# EAGLE schematic power (EAGLE 9.6.2)
Assembly variants: basic
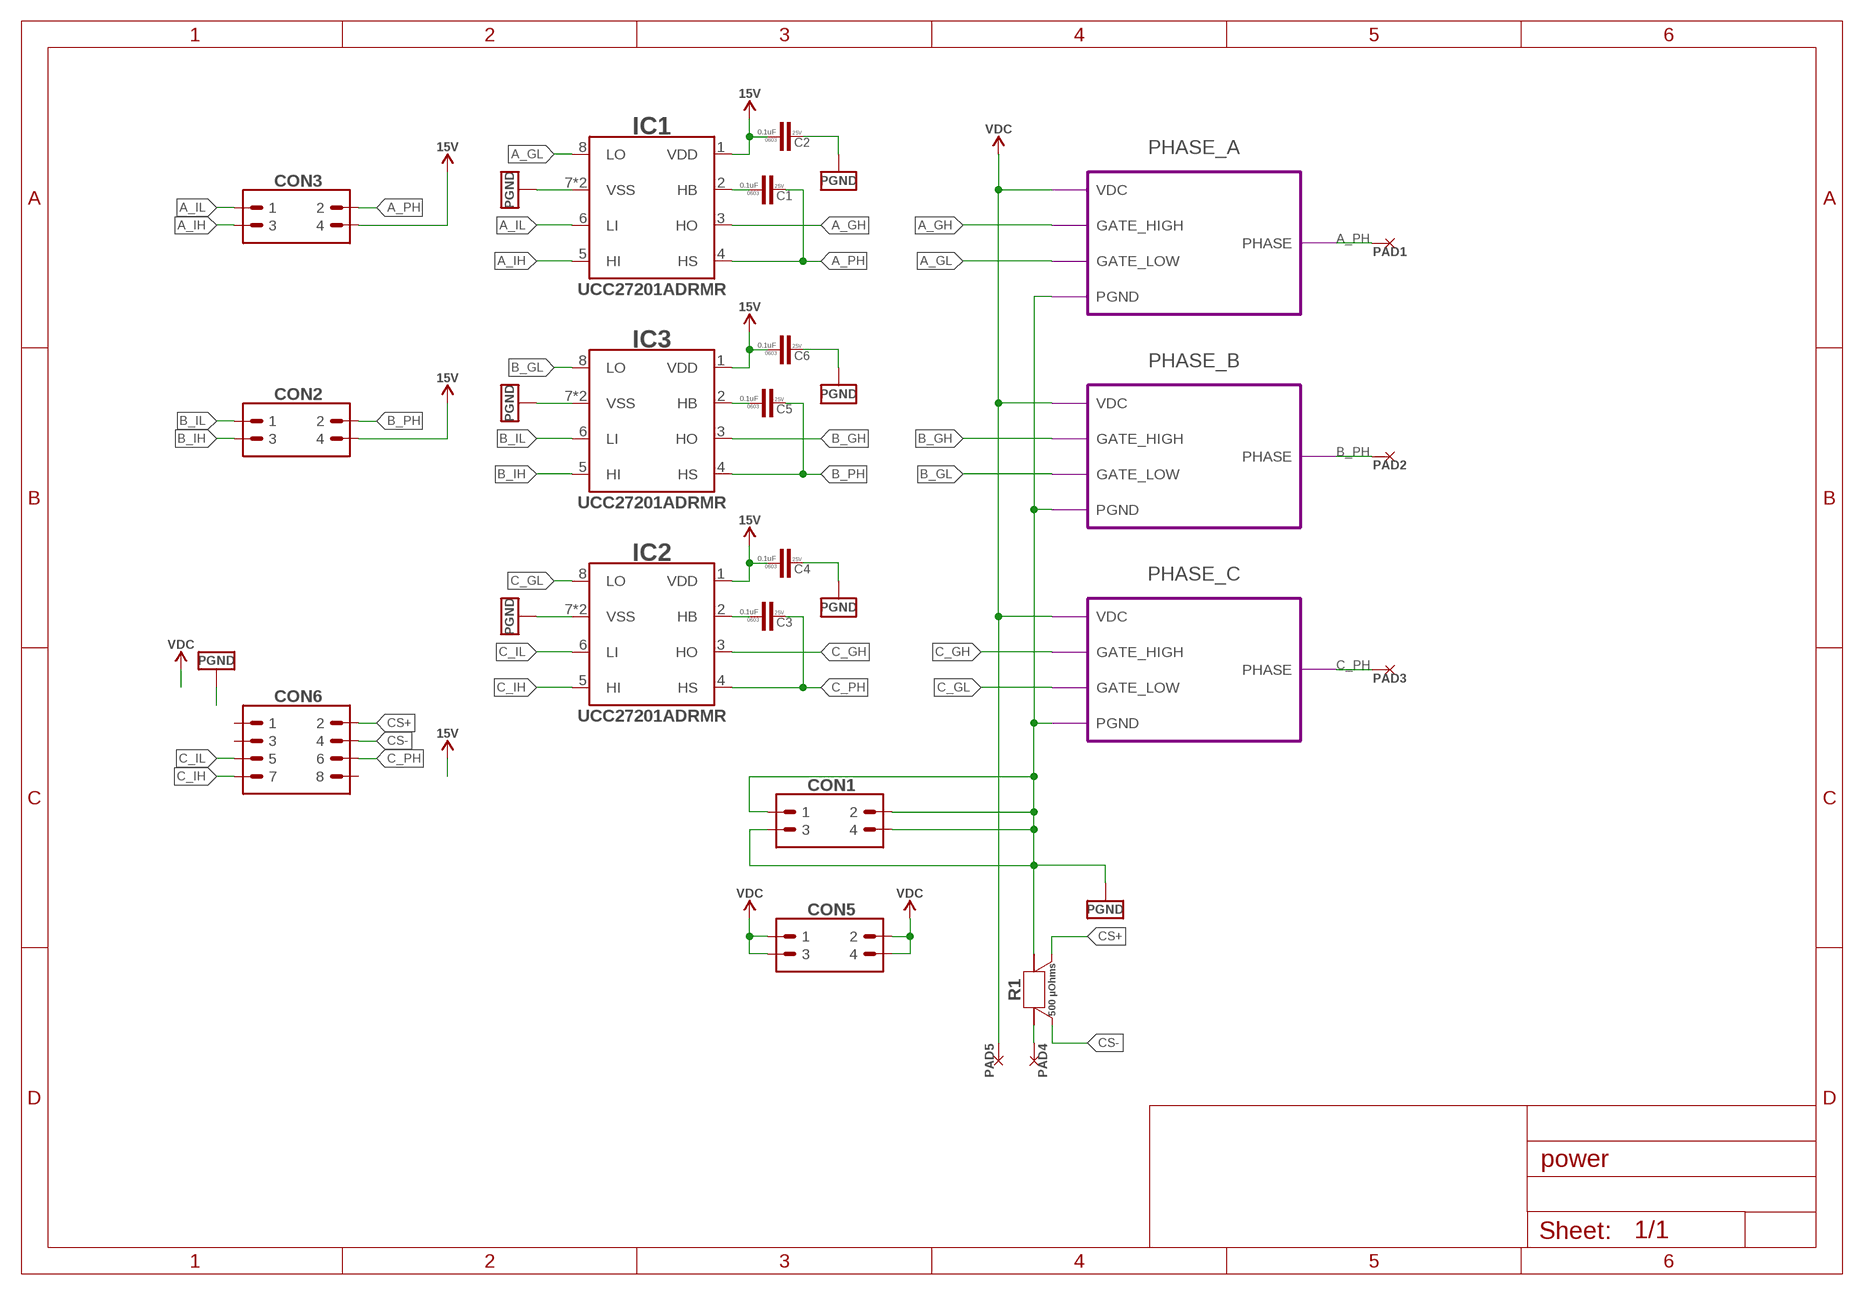
[diagram p0: schematic, sheet 1]

## Parts
C1  0.1uF  C-0603  [C0603]
C2  0.1uF  C-0603  [C0603]
C3  0.1uF  C-0603  [C0603]
C4  0.1uF  C-0603  [C0603]
C5  0.1uF  C-0603  [C0603]
C6  0.1uF  C-0603  [C0603]
CON1  PINHEAD_2X02-0877590414  [2X02-SMD-2-MALE]
CON2  PINHEAD_2X02-0877590414  [2X02-SMD-2-MALE]
CON3  PINHEAD_2X02-0877590414  [2X02-SMD-2-MALE]
CON5  PINHEAD_2X02-0877590414  [2X02-SMD-2-MALE]
CON6  PINHEAD_2X04-SMD-2-MALE  [2X04-SMD-2-MALE]
IC1  UCC272-VDFN-HEAVY_PCB  [VDFN-8-HEAVY-PCB]
IC2  UCC272-VDFN-HEAVY_PCB  [VDFN-8-HEAVY-PCB]
IC3  UCC272-VDFN-HEAVY_PCB  [VDFN-8-HEAVY-PCB]
PAD1  PAD-5X8  [5X8]  (not fitted in variant basic)
PAD2  PAD-5X8  [5X8]  (not fitted in variant basic)
PAD3  PAD-5X8  [5X8]  (not fitted in variant basic)
PAD4  PAD-5X4  [5X4]  (not fitted in variant basic)
PAD5  PAD-5X4  [5X4]  (not fitted in variant basic)
R1  500 µOhms  CURRENT_SHUNT_KELVIN-0.0005R-3920-KELVIN  [R3920-KELVIN]

## Module instances
PHASE_A = PHASE (part numbers offset by 100)
PHASE_B = PHASE (part numbers offset by 200)
PHASE_C = PHASE (part numbers offset by 300)

## Nets
A_GH: IC1.3(HO) ; port PHASE_A.GATE_HIGH
A_GL: IC1.8(LO) ; port PHASE_A.GATE_LOW
A_IH: CON3.3 IC1.5(HI)
A_IL: CON3.1 IC1.6(LI)
A_PH: C1.2 CON3.2 IC1.4(HS) PAD1.P$1 ; port PHASE_A.PHASE
B_GH: IC3.3(HO) ; port PHASE_B.GATE_HIGH
B_GL: IC3.8(LO) ; port PHASE_B.GATE_LOW
B_IH: CON2.3 IC3.5(HI)
B_IL: CON2.1 IC3.6(LI)
B_PH: C5.2 CON2.2 IC3.4(HS) PAD2.P$1 ; port PHASE_B.PHASE
C_GH: IC2.3(HO) ; port PHASE_C.GATE_HIGH
C_GL: IC2.8(LO) ; port PHASE_C.GATE_LOW
C_IH: CON6.7 IC2.5(HI)
C_IL: CON6.5 IC2.6(LI)
C_PH: C3.2 CON6.6 IC2.4(HS) PAD3.P$1 ; port PHASE_C.PHASE
CS+: CON6.2 R1.S2
CS-: CON6.4 R1.S1
N$1: C3.1 IC2.2(HB)
N$2: C5.1 IC3.2(HB)
N$7: PAD4.P$1 R1.1 R1.11
N$13: C1.1 IC1.2(HB)
PGND: C2.2 C4.2 C6.2 CON1.1 CON1.2 CON1.3 CON1.4 IC1.7(VSS) IC1.P$1(VSS) IC2.7(VSS) IC2.P$1(VSS) IC3.7(VSS) IC3.P$1(VSS) R1.2 R1.22 ; port PHASE_A.PGND PHASE_C.PGND PHASE_B.PGND
VDC [HV]: CON5.1 CON5.2 CON5.3 CON5.4 PAD5.P$1 ; port PHASE_B.VDC PHASE_A.VDC PHASE_C.VDC
VDD_15V: C2.1 C4.1 C6.1 CON2.4 CON3.4 IC1.1(VDD) IC2.1(VDD) IC3.1(VDD) ; supply symbol labelled 15V
Unconnected: CON6.1 CON6.3 CON6.8

## Library data of the parts
C1-C6 = rc:C; AEC-Q: ---; DIGIKEY#: 1276-1006-1-ND; MANF: Samsung Electro-Mechanics; MANF#: CL10B104KA8NNNC; OPERATING_TEMP: -55°C ~ 125°C; PACKAGE: 0603; VOLTAGE: 25V
CON1-CON3 CON5 = pinhead:PINHEAD_2X02; DIGIKEY#: WM18712-ND; MANF: Molex; MANF#: 0877590414
CON6 = pinhead:PINHEAD_2X04; DIGIKEY#: WM14802-ND; MANF: Molex; MANF#: 0877590814
IC1-IC3 = mosfet_drivers:UCC272: Half-Bridge Gate Driver IC Non-Inverting 8-SO PowerPad; DIGIKEY#: 296-UCC27201ADRMRTR-ND; LCSC#: C47661; MANF: Texas Instruments; MANF#: UCC27201ADRMR
PAD1-PAD3 = PADS:PAD
PAD4 PAD5 = PADS:PAD; BOM: EXCLUDE
R1 = SHUNT_RESISTORS:CURRENT_SHUNT_KELVIN; DIGIKEY#: CSS2H-3920R-L500FCT-ND; MANF: Bourns Inc; MANF#: CSS2H-3920R-L500F; OPERATING_TEMP: -55°C ~ 170°C; PACKAGE: 3920; POWER: 9W; TC: ±50ppm/°C; TOLERANCE: ±1%

## Module PHASE
Ports: GATE_HIGH(in) GATE_LOW(in) PHASE(io) PGND(pwr) VDC(pwr)
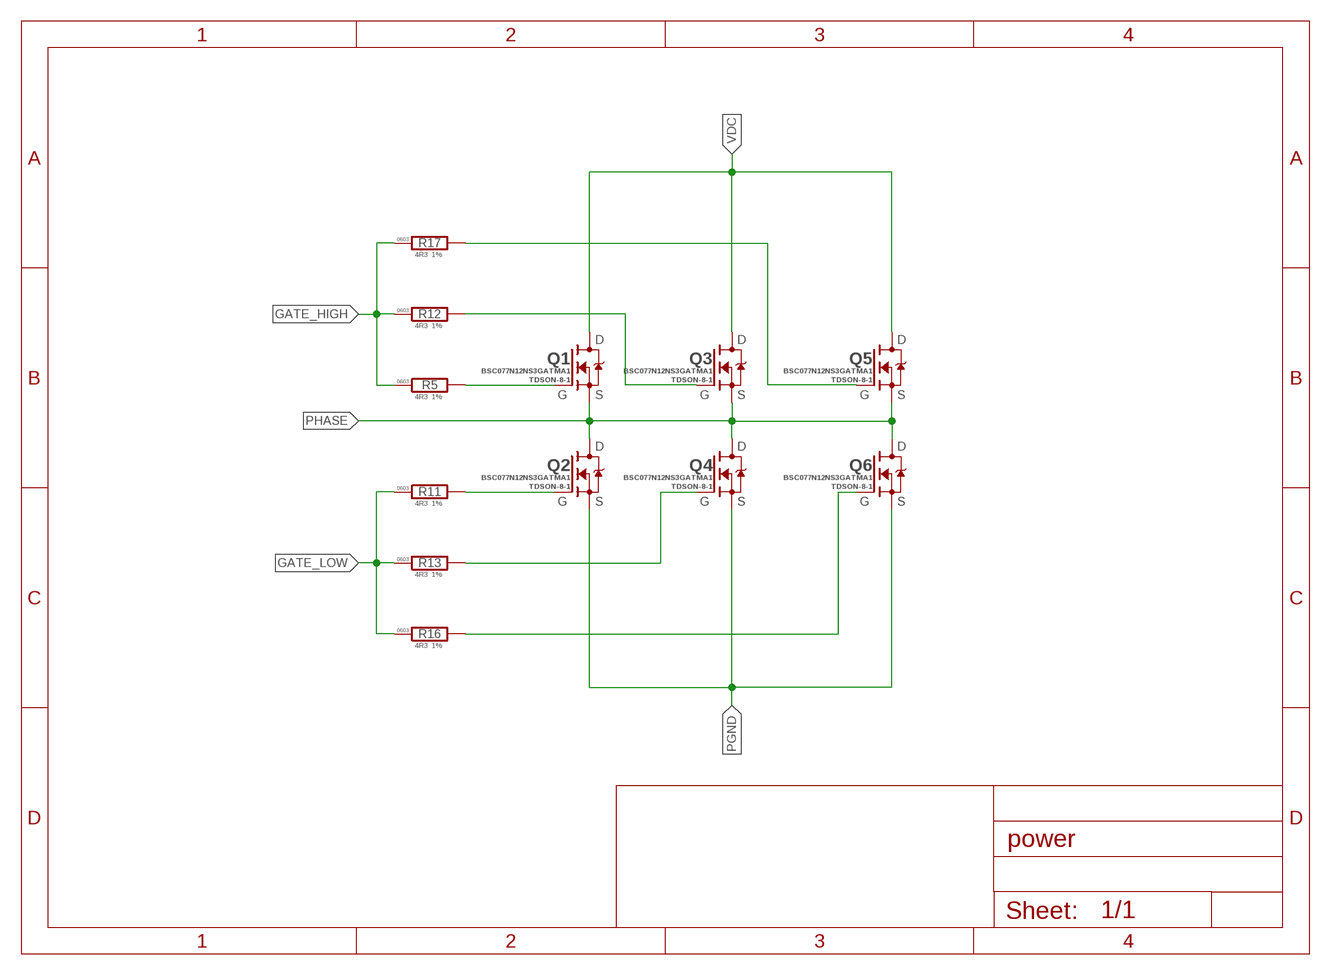
[diagram p1: schematic, module PHASE, sheet 1]

### Parts
Q1  BSC077N12NS3GATMA1  [PG-TDSON-8-1]
Q2  BSC077N12NS3GATMA1  [PG-TDSON-8-1]
Q3  BSC077N12NS3GATMA1  [PG-TDSON-8-1]
Q4  BSC077N12NS3GATMA1  [PG-TDSON-8-1]
Q5  BSC077N12NS3GATMA1  [PG-TDSON-8-1]
Q6  BSC077N12NS3GATMA1  [PG-TDSON-8-1]
R5  4R3  R-1%-0603  [R0603]
R11  4R3  R-1%-0603  [R0603]
R12  4R3  R-1%-0603  [R0603]
R13  4R3  R-1%-0603  [R0603]
R16  4R3  R-1%-0603  [R0603]
R17  4R3  R-1%-0603  [R0603]

### Nets
GATE_HIGH [HV]: R5.1 R12.1 R17.1
GATE_LOW: R11.1 R13.1 R16.1
N$1 [HV]: Q1.4(G) R5.2
N$2: Q2.4(G) R11.2
N$3 [HV]: Q3.4(G) R12.2
N$4: Q4.4(G) R13.2
N$5 [HV]: Q5.4(G) R17.2
N$6: Q6.4(G) R16.2
PGND: Q2.1(S) Q2.2(S) Q2.3(S) Q4.1(S) Q4.2(S) Q4.3(S) Q6.1(S) Q6.2(S) Q6.3(S)
PHASE [HV]: Q1.1(S) Q1.2(S) Q1.3(S) Q2.P$1(D) Q3.1(S) Q3.2(S) Q3.3(S) Q4.P$1(D) Q5.1(S) Q5.2(S) Q5.3(S) Q6.P$1(D)
VDC [HV]: Q1.P$1(D) Q3.P$1(D) Q5.P$1(D)

### Library data of the parts
Q1-Q6 = mosfet:BSC077N12NS3GATMA1: N-Channel 120V 13.4A (Ta), 98A (Tc) 139W (Tc) Surface Mount PG-TDSON-8-1; DIGIKEY#: BSC077N12NS3GATMA1CT-ND; MANF: Infineon Technologies; MANF#: BSC077N12NS3GATMA1; PACKAGE: TDSON-8-1
R5 R11-R13 R16 R17 = rc:R; AEC-Q: AEC-Q200; DIGIKEY#: 10-ERJ-U03F4R30VCT-ND; MANF: Panasonic Electronic Components; MANF#: ERJ-U03F4R30V; OPERATING_TEMP: -55°C ~ 155°C; PACKAGE: 0603; TOLERANCE: 1%

## Net classes
1 HV: clearance 0.25 mm to class 0, clearance 0.25 mm